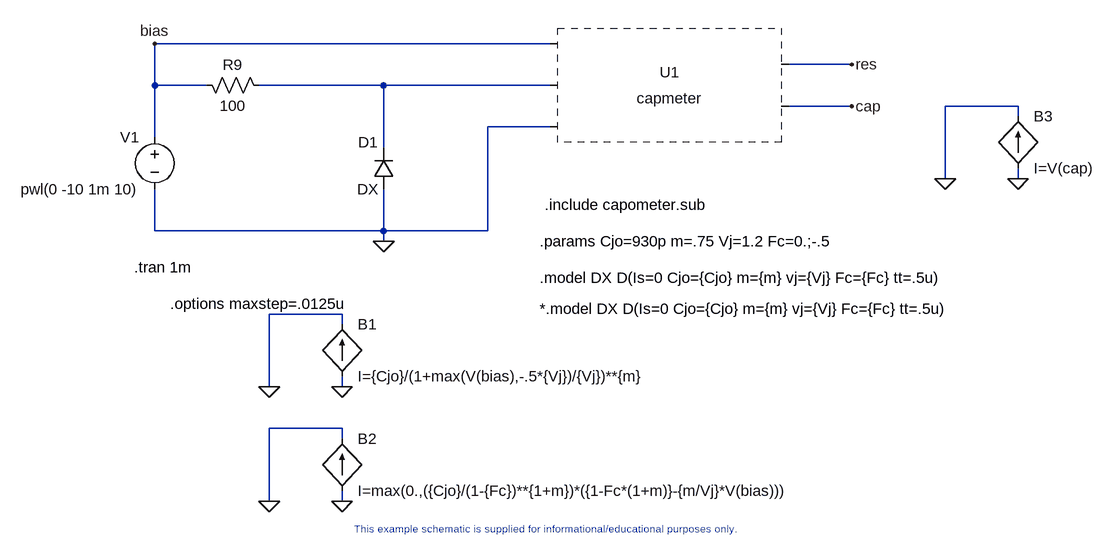
[diagram p0: schematic Fc.asc]
Fc.asc, the LTspice schematic file:
Version 4
SHEET 1 5945688 13421568
WIRE 2896 -672 2288 -672
WIRE 3360 -640 3264 -640
WIRE 2288 -608 2288 -672
WIRE 2368 -608 2288 -608
WIRE 2640 -608 2448 -608
WIRE 2896 -608 2640 -608
WIRE 3360 -576 3264 -576
WIRE 3616 -576 3504 -576
WIRE 3616 -560 3616 -576
WIRE 2896 -544 2800 -544
WIRE 2288 -528 2288 -608
WIRE 2640 -512 2640 -608
WIRE 3504 -464 3504 -576
WIRE 3616 -464 3616 -480
WIRE 2288 -384 2288 -448
WIRE 2640 -384 2640 -448
WIRE 2640 -384 2288 -384
WIRE 2800 -384 2800 -544
WIRE 2800 -384 2640 -384
WIRE 2640 -368 2640 -384
WIRE 2576 -256 2464 -256
WIRE 2576 -240 2576 -256
WIRE 2464 -144 2464 -256
WIRE 2576 -144 2576 -160
WIRE 2576 -80 2464 -80
WIRE 2576 -64 2576 -80
WIRE 2464 32 2464 -80
WIRE 2576 32 2576 16
FLAG 2640 -368 0
FLAG 2576 -144 0
FLAG 2464 -144 0
FLAG 2288 -672 bias
FLAG 3360 -576 cap
FLAG 3360 -640 res
FLAG 2576 32 0
FLAG 2464 32 0
FLAG 3616 -464 0
FLAG 3504 -464 0
SYMBOL voltage 2288 -544 M0
SYMATTR InstName V1
SYMATTR Value pwl(0 -10 1m 10)
SYMBOL res 2352 -624 M90
WINDOW 0 0 56 VBottom 2
WINDOW 3 32 56 VTop 2
SYMATTR InstName R9
SYMATTR Value 100
SYMBOL diode 2656 -448 R180
WINDOW 0 24 72 Left 2
WINDOW 3 24 0 Left 2
SYMATTR InstName D1
SYMATTR Value DX
SYMBOL bi2 2576 -240 R0
SYMATTR InstName B1
SYMATTR Value I={Cjo}/(1+max(V(bias),-.5*{Vj})/{Vj})**{m}
SYMBOL capmeter 2976 -640 R0
SYMATTR InstName U1
SYMATTR SpiceLine current=1m freq=3Meg C=.25µ
SYMBOL bi2 2576 -64 R0
SYMATTR InstName B2
SYMATTR Value I=max(0.,({Cjo}/(1-{Fc})**{1+m})*({1-Fc*(1+m)}-{m/Vj}*V(bias)))
SYMBOL bi2 3616 -560 R0
SYMATTR InstName B3
SYMATTR Value I=V(cap)
TEXT 2256 -328 Left 2 !.tran 1m
TEXT 2312 -272 Left 2 !.options maxstep=.0125u
TEXT 2880 -368 Left 2 !.params Cjo=930p m=.75 Vj=1.2 Fc=0.;-.5
TEXT 2888 -424 Left 2 !.include capometer.sub
TEXT 2880 -312 Left 2 !.model DX D(Is=0 Cjo={Cjo} m={m} vj={Vj} Fc={Fc} tt=.5u)
TEXT 2880 -264 Left 2 !*.model DX D(Is=0 Cjo={Cjo} m={m} vj={Vj} Fc={Fc} tt=.5u)
TEXT 2880 64 Top 1 ;This example schematic is supplied for informational/educational purposes only.

The netlist it stands for:
* Fc.asc
V1 bias 0 pwl(0 -10 1m 10)
R9 bias N001 100
D1 0 N001 DX
B1 0 0 I={Cjo}/(1+max(V(bias),-.5*{Vj})/{Vj})**{m}
* U1: capmeter current=1m freq=3Meg C=.25µ (symbol capmeter not available, pin order unknown); nets seen at it: 0, bias, cap, N001, res
B2 0 0 I=max(0.,({Cjo}/(1-{Fc})**{1+m})*({1-Fc*(1+m)}-{m/Vj}*V(bias)))
B3 0 0 I=V(cap)
.model D D
.lib standard.dio
.tran 1m
.options maxstep=.0125u
.params Cjo=930p m=.75 Vj=1.2 Fc=0.;-.5
.include capometer.sub
.model DX D(Is=0 Cjo={Cjo} m={m} vj={Vj} Fc={Fc} tt=.5u)
*.model DX D(Is=0 Cjo={Cjo} m={m} vj={Vj} Fc={Fc} tt=.5u)
* This example schematic is supplied for informational/educational purposes only.
.backanno
.end